# EAGLE schematic AlarmSt (EAGLE 4.16)

## Sheet 1 of 4
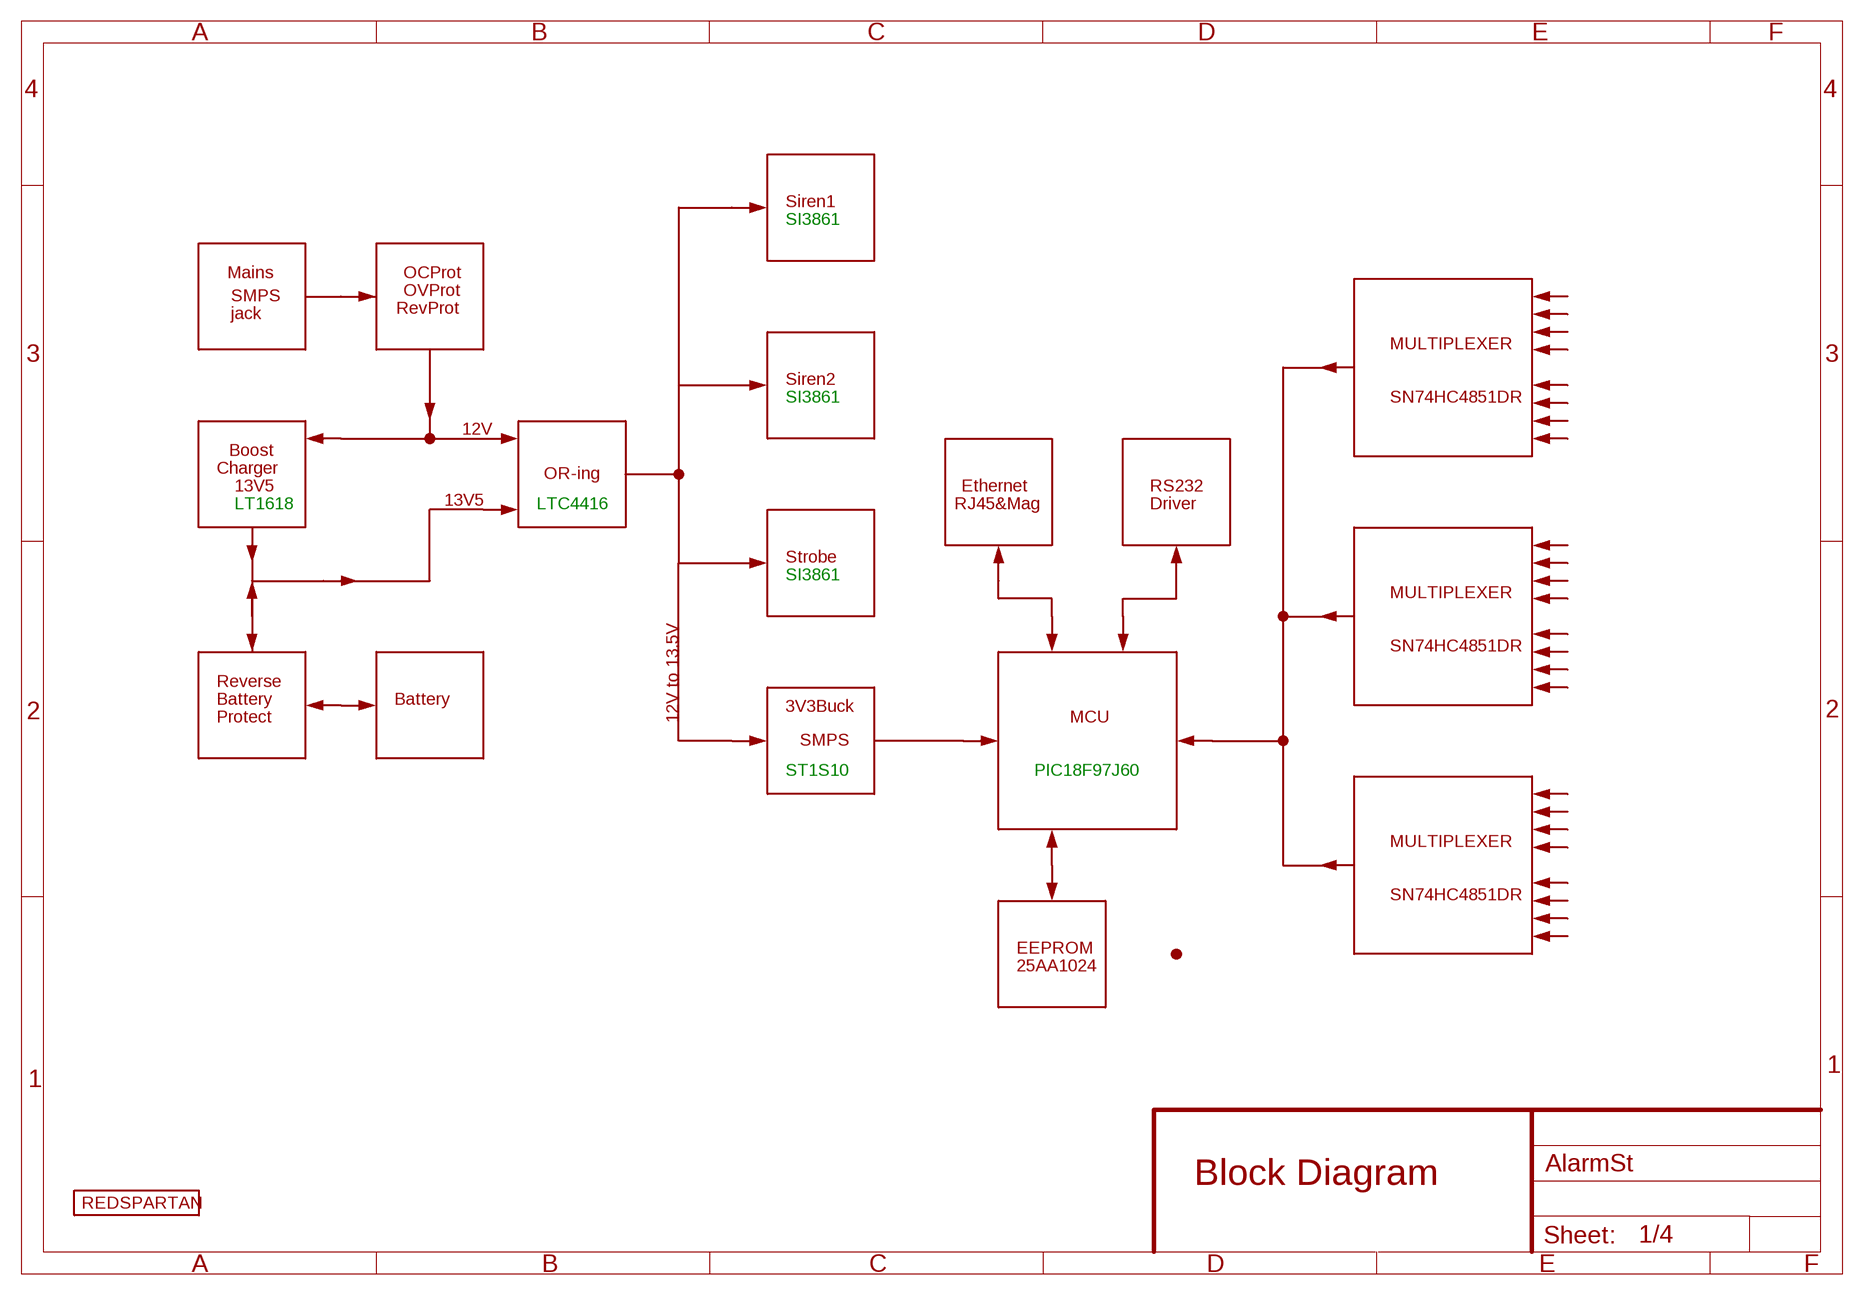
[diagram p0: schematic, sheet 1]

### Parts
LOGO1  LOGO-REDSPARTAN-2  [LOGO-REDSPARTAN-2]

### Notes on the sheet
- Siren1
- SI3861
- Mains | OCProt
- OVProt
- SMPS
- RevProt
- jack
- MULTIPLEXER
- Siren2
- SI3861 | SN74HC4851DR
- 12V
- Boost
- Charger
- OR-ing
- 13V5 | Ethernet | RS232
- LT1618 | 13V5 | LTC4416 | RJ45&Mag | Driver
- Strobe
- SI3861
- MULTIPLEXER
- SN74HC4851DR
- Reverse
- Battery | Battery
- 3V3Buck
- Protect | 12V to 13.5V | MCU
- SMPS
- ST1S10 | PIC18F97J60
- MULTIPLEXER
- SN74HC4851DR
- EEPROM
- 25AA1024
- Block Diagram

## Sheet 2 of 4
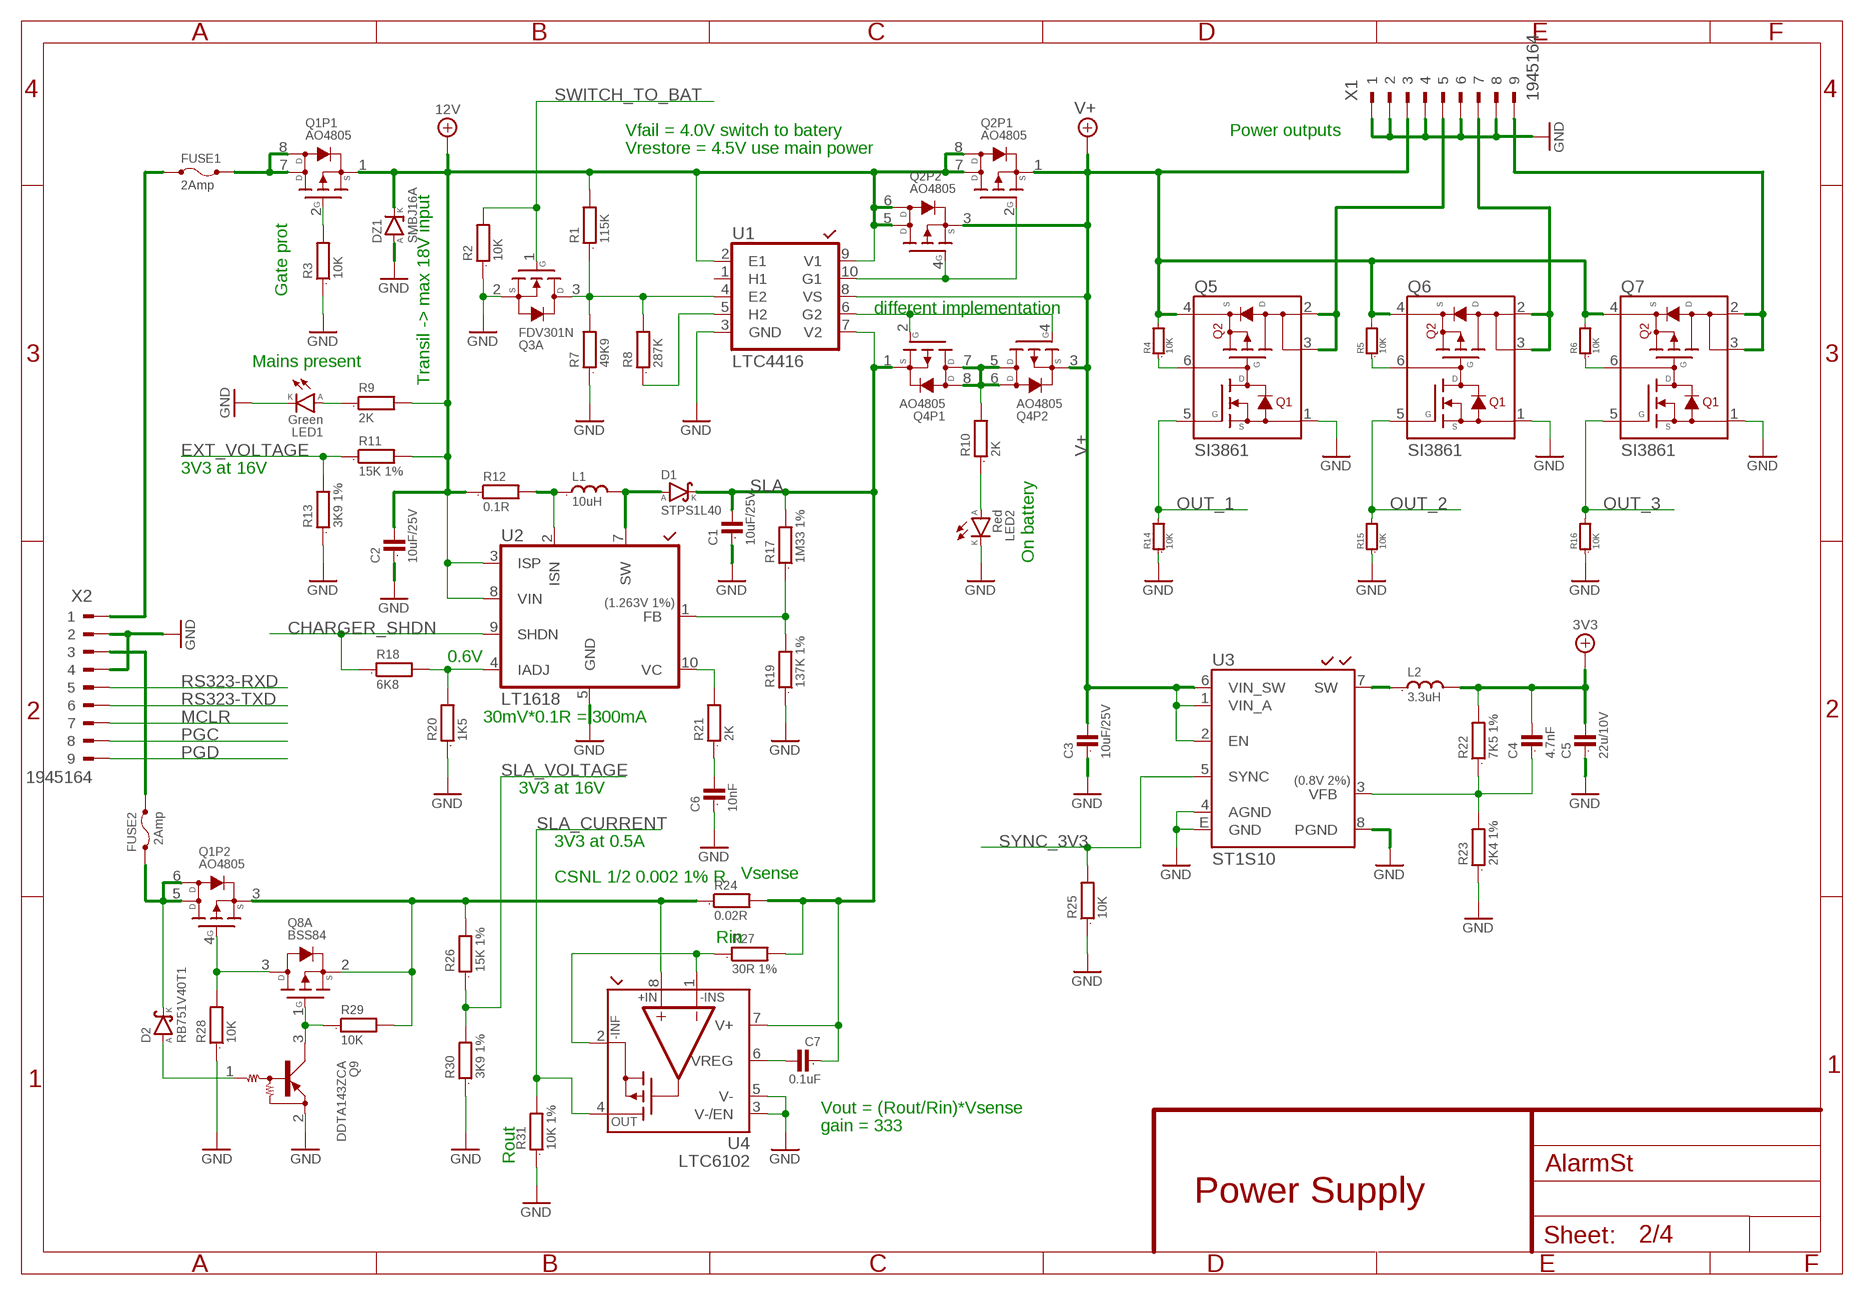
[diagram p1: schematic, sheet 2]

### Parts
C1  10uF/25V  C1206  [1206]
C2  10uF/25V  C1206  [1206]
C3  10uF/25V  C1206  [1206]
C4  4.7nF  C0603  [0603]
C5  22u/10V  C1206  [1206]
C6  10nF  C0603  [0603]
C7  0.1uF  C0603  [0603]
D1  STPS1L40  DIODE-SCHOTTKY_SMA  [SMA]
D2  RB751V40T1  DIODE-SCHOTTKY_SOD323  [SOD323]
DZ1  SMBJ16A  DIODE-ZENER_SMB  [SMB]
FUSE1  2Amp  FUSE1210  [1210]
FUSE2  2Amp  FUSE1210  [1210]
L1  10uH  L_VLS3015  [VLS3015]
L2  3.3uH  L_VLS3015  [VLS3015]
LED1  Green  LED0805  [LED0805]
LED2  Red  LED0805  [LED0805]
Q1  AO4805  TRANSISTOR-MOSFET-PAIR-P&P-8P_SO08  [SO08]
Q2  AO4805  TRANSISTOR-MOSFET-PAIR-P&P-8P_SO08  [SO08]
Q3  FDV301N  TRANSISTOR-MOSFET-N-ENH_SOT23-1  [SOT23]
Q4  AO4805  TRANSISTOR-MOSFET-PAIR-P&P-8P_SO08  [SO08]
Q5  SI3861  TRANSISTOR-MOSFET-PAIR-SWITCH-1_SSOT6  [SSOT6]
Q6  SI3861  TRANSISTOR-MOSFET-PAIR-SWITCH-1_SSOT6  [SSOT6]
Q7  SI3861  TRANSISTOR-MOSFET-PAIR-SWITCH-1_SSOT6  [SSOT6]
Q8  BSS84  TRANSISTOR-MOSFET-P-ENH_SOT23-1  [SOT23]
Q9  DDTA143ZCA  TRANSISTOR-BJT-PNP-DRIVER-RB-RE_SOT23  [SOT23]
R1  115K  R0603  [0603]
R2  10K  R0603  [0603]
R3  10K  R0603  [0603]
R4  10K  R-SMALL0603  [0603]
R5  10K  R-SMALL0603  [0603]
R6  10K  R-SMALL0603  [0603]
R7  49K9  R0603  [0603]
R8  287K  R0603  [0603]
R9  2K  R0603  [0603]
R10  2K  R0603  [0603]
R11  15K 1%  R0603  [0603]
R12  0.1R  R0805  [0805]
R13  3K9 1%  R0603  [0603]
R14  10K  R-SMALL0603  [0603]
R15  10K  R-SMALL0603  [0603]
R16  10K  R-SMALL0603  [0603]
R17  1M33 1%  R0603  [0603]
R18  6K8  R0603  [0603]
R19  137K 1%  R0603  [0603]
R20  1K5  R0603  [0603]
R21  2K  R0603  [0603]
R22  7K5 1%  R0603  [0603]
R23  2K4 1%  R0603  [0603]
R24  0.02R  R1210  [1210]
R25  10K  R0603  [0603]
R26  15K 1%  R0603  [0603]
R27  30R 1%  R0603  [0603]
R28  10K  R0603  [0603]
R29  10K  R0603  [0603]
R30  3K9 1%  R0603  [0603]
R31  10K 1%  R0603  [0603]
U1  LTC4416  [MSOP10]
U2  LT1618  [MSOP10]
U3  ST1S10  ST1S10_SO08  [SO08E]
U4  LTC6102  [MSOP8]
X1  1945164  180-9  [180-9]
X2  1945164  180-9  [180-9]

### Nets
3V3 [POWER]: C4.2 C5.2 L2.2 R22.2 ; also sheet 3,4
12V: C2.2 DZ1.K Q1.1(P1:S) Q2.5(P2:D) Q2.6(P2-D2:D) Q2.7(P1:D) Q2.8(P1-D2:D) R1.2 R9.2 R11.2 R12.1 U1.2(E1) U1.9(V1) U2.3(ISP) U2.8(VIN)
12V_FUSED [POWER]: FUSE1.2 Q1.7(P1:D) Q1.8(P1-D2:D)
CHARGER_SHDN: R18.1 U2.9(SHDN) ; also sheet 3
EXT_VOLTAGE: R11.1 R13.2 ; also sheet 3
GND: C1.1 C2.1 C3.1 C5.1 C6.1 DZ1.A LED1.K LED2.K Q3.2(A:S) Q5.1(Q1S) Q6.1(Q1S) Q7.1(Q1S) Q9.2(E) R2.1 R3.1 R7.1 R13.1 R14.1 R15.1 R16.1 R19.1 R20.1 R23.1 R25.1 R28.1 R30.1 R31.1 U1.3(GND) U2.5(GND) U3.4(AGND) U3.8(PGND) U3.E(GND) U4.3(V-/EN) U4.5(V-) X1.1 X1.2 X1.4 X1.6 X1.8 X2.2 X2.4 ; also sheet 3,4
MCLR: X2.7 ; also sheet 3
N$1: Q4.5(P2:D) Q4.6(P2-D2:D) Q4.7(P1:D) Q4.8(P1-D2:D) R10.2
N$2: Q4.2(P1G:G) Q4.4(P2G:G) U1.6(G2)
N$3: Q1.3(P2:S) Q8.2(A:S) R24.1 R26.2 R29.2 U4.8(+IN)
N$4: Q2.2(P1G:G) Q2.4(P2G:G) U1.10(G1)
N$5: D1.A L1.2 U2.7(SW)
N$6: L1.1 R12.2 U2.2(ISN)
N$7: R21.2 U2.10(VC)
N$8: Q3.3(A:D) R1.1 R7.2 R8.2 U1.4(E2)
N$9: R18.2 R20.2 U2.4(IADJ)
N$10: C6.2 R21.1
N$11: R17.1 R19.2 U2.1(FB)
N$13: R8.1 U1.5(H2)
N$20: Q5.2(Q2D) Q5.3(Q2D) X1.5
N$21: Q6.2(Q2D) Q6.3(Q2D) X1.7
N$22: Q7.2(Q2D) Q7.3(Q2D) X1.9
N$23: Q5.6(Q2G) R4.1
N$24: Q6.6(Q2G) R5.1
N$25: Q7.6(Q2G) R6.1
N$29: FUSE1.1 X2.1
N$30: Q1.4(P2G:G) Q8.3(A:D) R28.2
N$31: FUSE2.1 X2.3
N$32: Q8.1(G:G) Q9.3(C) R29.1
N$33: D2.A Q9.1(B)
N$35: LED1.A R9.1
N$36: LED2.A R10.1
N$69: D2.K FUSE2.2 Q1.5(P2:D) Q1.6(P2-D2:D)
N$71: R27.1 U4.1(-INS) U4.2(-INF)
N$72: C7.2 U4.6(VREG)
OUT_1: Q5.5(Q1G) R14.2 ; also sheet 3
OUT_2: Q6.5(Q1G) R15.2 ; also sheet 3
OUT_3: Q7.5(Q1G) R16.2 ; also sheet 3
PGC: X2.8 ; also sheet 3
PGD: X2.9 ; also sheet 3
REV_PROT_GATE: Q1.2(P1G:G) R3.2
RS323-RXD: X2.5 ; also sheet 3
RS323-TXD: X2.6 ; also sheet 3
SLA: C1.2 C7.1 D1.K Q4.1(P1:S) R17.2 R24.2 R27.2 U1.7(V2) U4.7(V+)
SLA_CURRENT: R31.2 U4.4(OUT) ; also sheet 3
SLA_VOLTAGE: R26.1 R30.2 ; also sheet 3
SW_3V3 [POWER]: L2.1 U3.7(SW)
SWITCH_TO_BAT: Q3.1(G:G) R2.2 ; also sheet 3
SYNC_3V3: R25.2 U3.5(SYNC) ; also sheet 3
V+: C3.2 Q2.1(P1:S) Q2.3(P2:S) Q4.3(P2:S) Q5.4(Q2S) Q6.4(Q2S) Q7.4(Q2S) R4.2 R5.2 R6.2 U1.8(VS) U3.1(VIN_A) U3.2(EN) U3.6(VIN_SW) X1.3
VFB_3V3: C4.1 R22.1 R23.2 U3.3(VFB)
Unconnected: U1.1(H1)

### Notes on the sheet
- Vfail = 4.0V switch to batery | Power outputs
- Vrestore = 4.5V use main power
- Gate prot
- different implementation
- Mains present
- Transil -> max 18V input
- 3V3 at 16V
- On battery
- 0.6V
- 30mV*0.1R = 300mA
- 3V3 at 16V
- 3V3 at 0.5A
- CSNL 1/2 0.002 1% R | Vsense
- Rin
- Vout = (Rout/Rin)*Vsense
- gain = 333
- Rout
- Power Supply

## Sheet 3 of 4
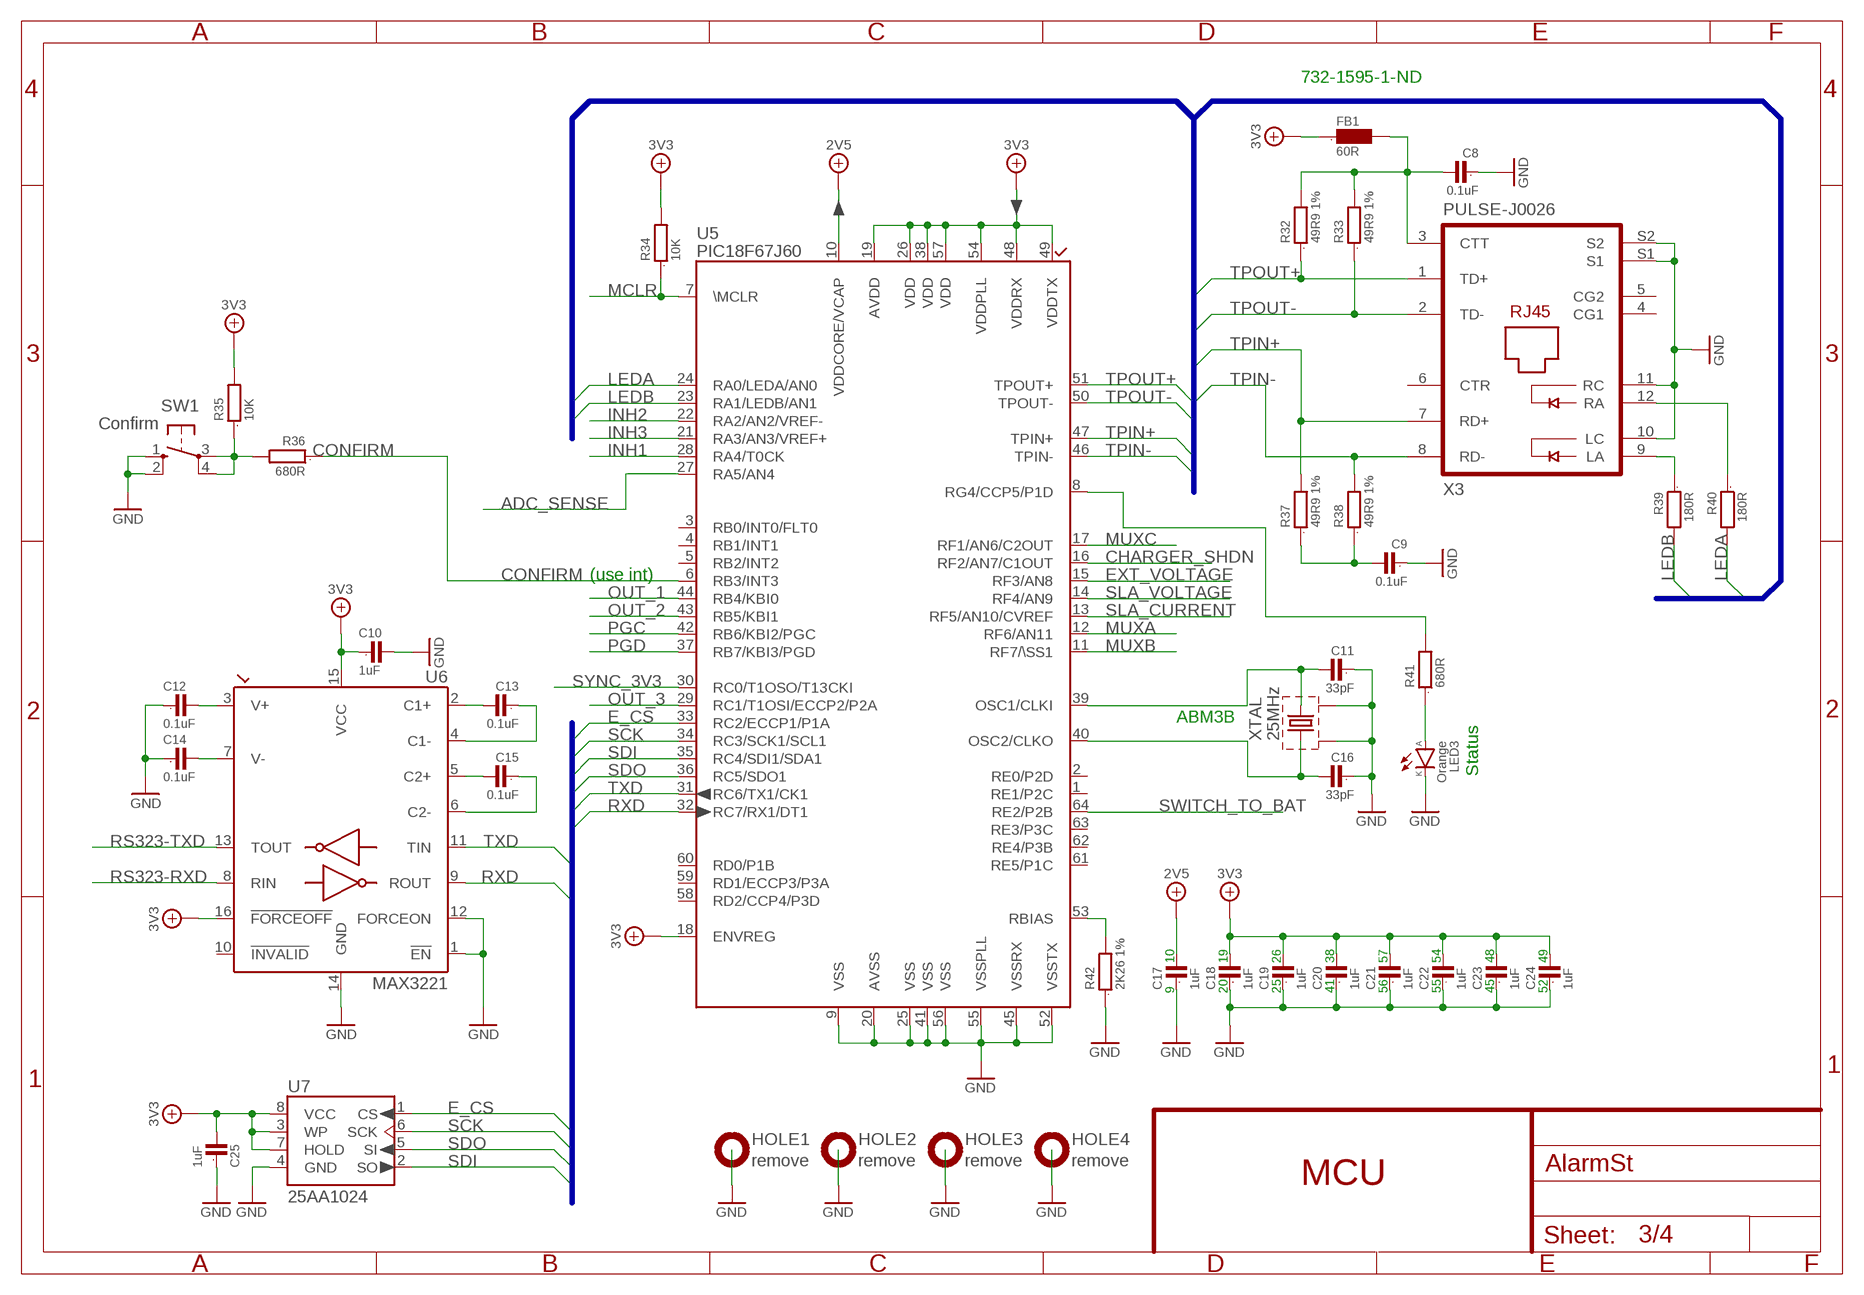
[diagram p2: schematic, sheet 3]

### Parts
C8  0.1uF  C0603  [0603]
C9  0.1uF  C0603  [0603]
C10  1uF  C0603  [0603]
C11  33pF  C0603  [0603]
C12  0.1uF  C0603  [0603]
C13  0.1uF  C0603  [0603]
C14  0.1uF  C0603  [0603]
C15  0.1uF  C0603  [0603]
C16  33pF  C0603  [0603]
C17  1uF  C0603  [0603]
C18  1uF  C0603  [0603]
C19  1uF  C0603  [0603]
C20  1uF  C0603  [0603]
C21  1uF  C0603  [0603]
C22  1uF  C0603  [0603]
C23  1uF  C0603  [0603]
C24  1uF  C0603  [0603]
C25  1uF  C0603  [0603]
FB1  60R  FB0603  [0603]
HOLE1  remove  MOUNTING-HOLE_3.2  [MOUNTING-HOLE-3.2MM]
HOLE2  remove  MOUNTING-HOLE_3.2  [MOUNTING-HOLE-3.2MM]
HOLE3  remove  MOUNTING-HOLE_3.2  [MOUNTING-HOLE-3.2MM]
HOLE4  remove  MOUNTING-HOLE_3.2  [MOUNTING-HOLE-3.2MM]
LED3  Orange  LED0805  [LED0805]
R32  49R9 1%  R0603  [0603]
R33  49R9 1%  R0603  [0603]
R34  10K  R0603  [0603]
R35  10K  R0603  [0603]
R36  680R  R0603  [0603]
R37  49R9 1%  R0603  [0603]
R38  49R9 1%  R0603  [0603]
R39  180R  R0603  [0603]
R40  180R  R0603  [0603]
R41  680R  R0603  [0603]
R42  2K26 1%  R0603  [0603]
SW1  Confirm  BUTTON-10-XX  [BUTTON-B3F-10XX]
U5  PIC18F67J60  PIC18F6XJ6X  [TQFP64]
U6  MAX3221  [TSSOP16]
U7  25AA1024  DIGITAL-EEPROM-SPI-8P  [SO08]
X3  PULSE-J0026  [PULSE-PJ-J0]
XTAL  25MHz  CRYSTAL-4P_ABM3B  [ABM3B]

### Nets
2V5: C17.2 U5.10(VDDCORE/VCAP)
3V3 [POWER]: C10.1 C18.2 C19.2 C20.2 C21.2 C22.2 C23.2 C24.2 C25.2 FB1.1 R34.2 R35.2 U5.18(ENVREG) U5.19(AVDD) U5.26(VDD) U5.38(VDD) U5.48(VDDRX) U5.49(VDDTX) U5.54(VDDPLL) U5.57(VDD) U6.15(VCC) U6.16(!FORCEOFF) U7.3(WP) U7.7(HOLD) U7.8(VCC) ; also sheet 2,4
ADC_SENSE: U5.27(RA5/AN4) ; also sheet 4
CHARGER_SHDN: U5.16(RF2/AN7/C1OUT) ; also sheet 2
CONFIRM: R36.1 U5.6(RB3/INT3)
E_CS: U5.33(RC2/ECCP1/P1A) U7.1(CS)
EXT_VOLTAGE: U5.15(RF3/AN8) ; also sheet 2
GND: C8.1 C9.1 C10.2 C11.1 C12.1 C14.1 C16.1 C17.1 C18.1 C19.1 C20.1 C21.1 C22.1 C23.1 C24.1 C25.1 HOLE1.VIA(MOUNT) HOLE2.VIA(MOUNT) HOLE3.VIA(MOUNT) HOLE4.VIA(MOUNT) LED3.K R42.1 SW1.1(S) SW1.2(S1) U5.9(VSS) U5.20(AVSS) U5.25(VSS) U5.41(VSS) U5.45(VSSRX) U5.52(VSSTX) U5.55(VSSPLL) U5.56(VSS) U6.1(!EN) U6.12(FORCEON) U6.14(GND) U7.4(GND) X3.10(LC) X3.11(RC) X3.S1 X3.S2 XTAL.2(SH1) XTAL.4(SH2) ; also sheet 2,4
INH1: U5.28(RA4/T0CK) ; also sheet 4
INH2: U5.22(RA2/AN2/VREF-) ; also sheet 4
INH3: U5.21(RA3/AN3/VREF+) ; also sheet 4
LEDA: R40.2 U5.24(RA0/LEDA/AN0)
LEDB: R39.2 U5.23(RA1/LEDB/AN1)
MCLR: R34.1 U5.7(\MCLR) ; also sheet 2
MUXA: U5.12(RF6/AN11) ; also sheet 4
MUXB: U5.11(RF7/\SS1) ; also sheet 4
MUXC: U5.17(RF1/AN6/C2OUT) ; also sheet 4
N$12: R40.1 X3.12(RA)
N$14: R42.2 U5.53(RBIAS)
N$15: C9.2 R37.1 R38.1
N$16: C8.2 FB1.2 R32.2 R33.2 X3.3(CTT)
N$17: R39.1 X3.9(LA)
N$18: C11.2 U5.39(OSC1/CLKI) XTAL.3
N$19: C16.2 U5.40(OSC2/CLKO) XTAL.1
N$26: R41.2 U5.8(RG4/CCP5/P1D)
N$34: C12.2 U6.3(V+)
N$38: LED3.A R41.1
N$63: R35.1 R36.2 SW1.3(P) SW1.4(P1)
N$64: C14.2 U6.7(V-)
N$65: C13.2 U6.2(C1+)
N$66: C13.1 U6.4(C1-)
N$67: C15.2 U6.5(C2+)
N$68: C15.1 U6.6(C2-)
OUT_1: U5.44(RB4/KBI0) ; also sheet 2
OUT_2: U5.43(RB5/KBI1) ; also sheet 2
OUT_3: U5.29(RC1/T1OSI/ECCP2/P2A) ; also sheet 2
PGC: U5.42(RB6/KBI2/PGC) ; also sheet 2
PGD: U5.37(RB7/KBI3/PGD) ; also sheet 2
RS323-RXD: U6.8(RIN) ; also sheet 2
RS323-TXD: U6.13(TOUT) ; also sheet 2
RXD: U5.32(RC7/RX1/DT1) U6.9(ROUT)
SCK: U5.34(RC3/SCK1/SCL1) U7.6(SCK)
SDI: U5.35(RC4/SDI1/SDA1) U7.2(SO)
SDO: U5.36(RC5/SDO1) U7.5(SI)
SLA_CURRENT: U5.13(RF5/AN10/CVREF) ; also sheet 2
SLA_VOLTAGE: U5.14(RF4/AN9) ; also sheet 2
SWITCH_TO_BAT: U5.64(RE2/P2B) ; also sheet 2
SYNC_3V3: U5.30(RC0/T1OSO/T13CKI) ; also sheet 2
TPIN+: R37.2 U5.47(TPIN+) X3.7(RD+)
TPIN-: R38.2 U5.46(TPIN-) X3.8(RD-)
TPOUT+: R32.1 U5.51(TPOUT+) X3.1(TD+)
TPOUT-: R33.1 U5.50(TPOUT-) X3.2(TD-)
TXD: U5.31(RC6/TX1/CK1) U6.11(TIN)
Unconnected: U5.1(RE1/P2C) U5.2(RE0/P2D) U5.3(RB0/INT0/FLT0) U5.4(RB1/INT1) U5.5(RB2/INT2) U5.58(RD2/CCP4/P3D) U5.59(RD1/ECCP3/P3A) U5.60(RD0/P1B) U5.61(RE5/P1C) U5.62(RE4/P3B) U5.63(RE3/P3C) U6.10(!INVALID) X3.4(CG1) X3.5(CG2) X3.6(CTR)

### Buses
E_CS,SCK,SDO,SDI,TXD,RXD
TPOUT+,TPOUT-,TPIN+,TPIN-,LEDA,LEDB

### Notes on the sheet
- 732-1595-1-ND
- (use int)
- ABM3B
- Status
- 10 | 19 | 26 | 38 | 57 | 54 | 48 | 49
- 9 | 20 | 25 | 41 | 56 | 55 | 45 | 52
- MCU

## Sheet 4 of 4
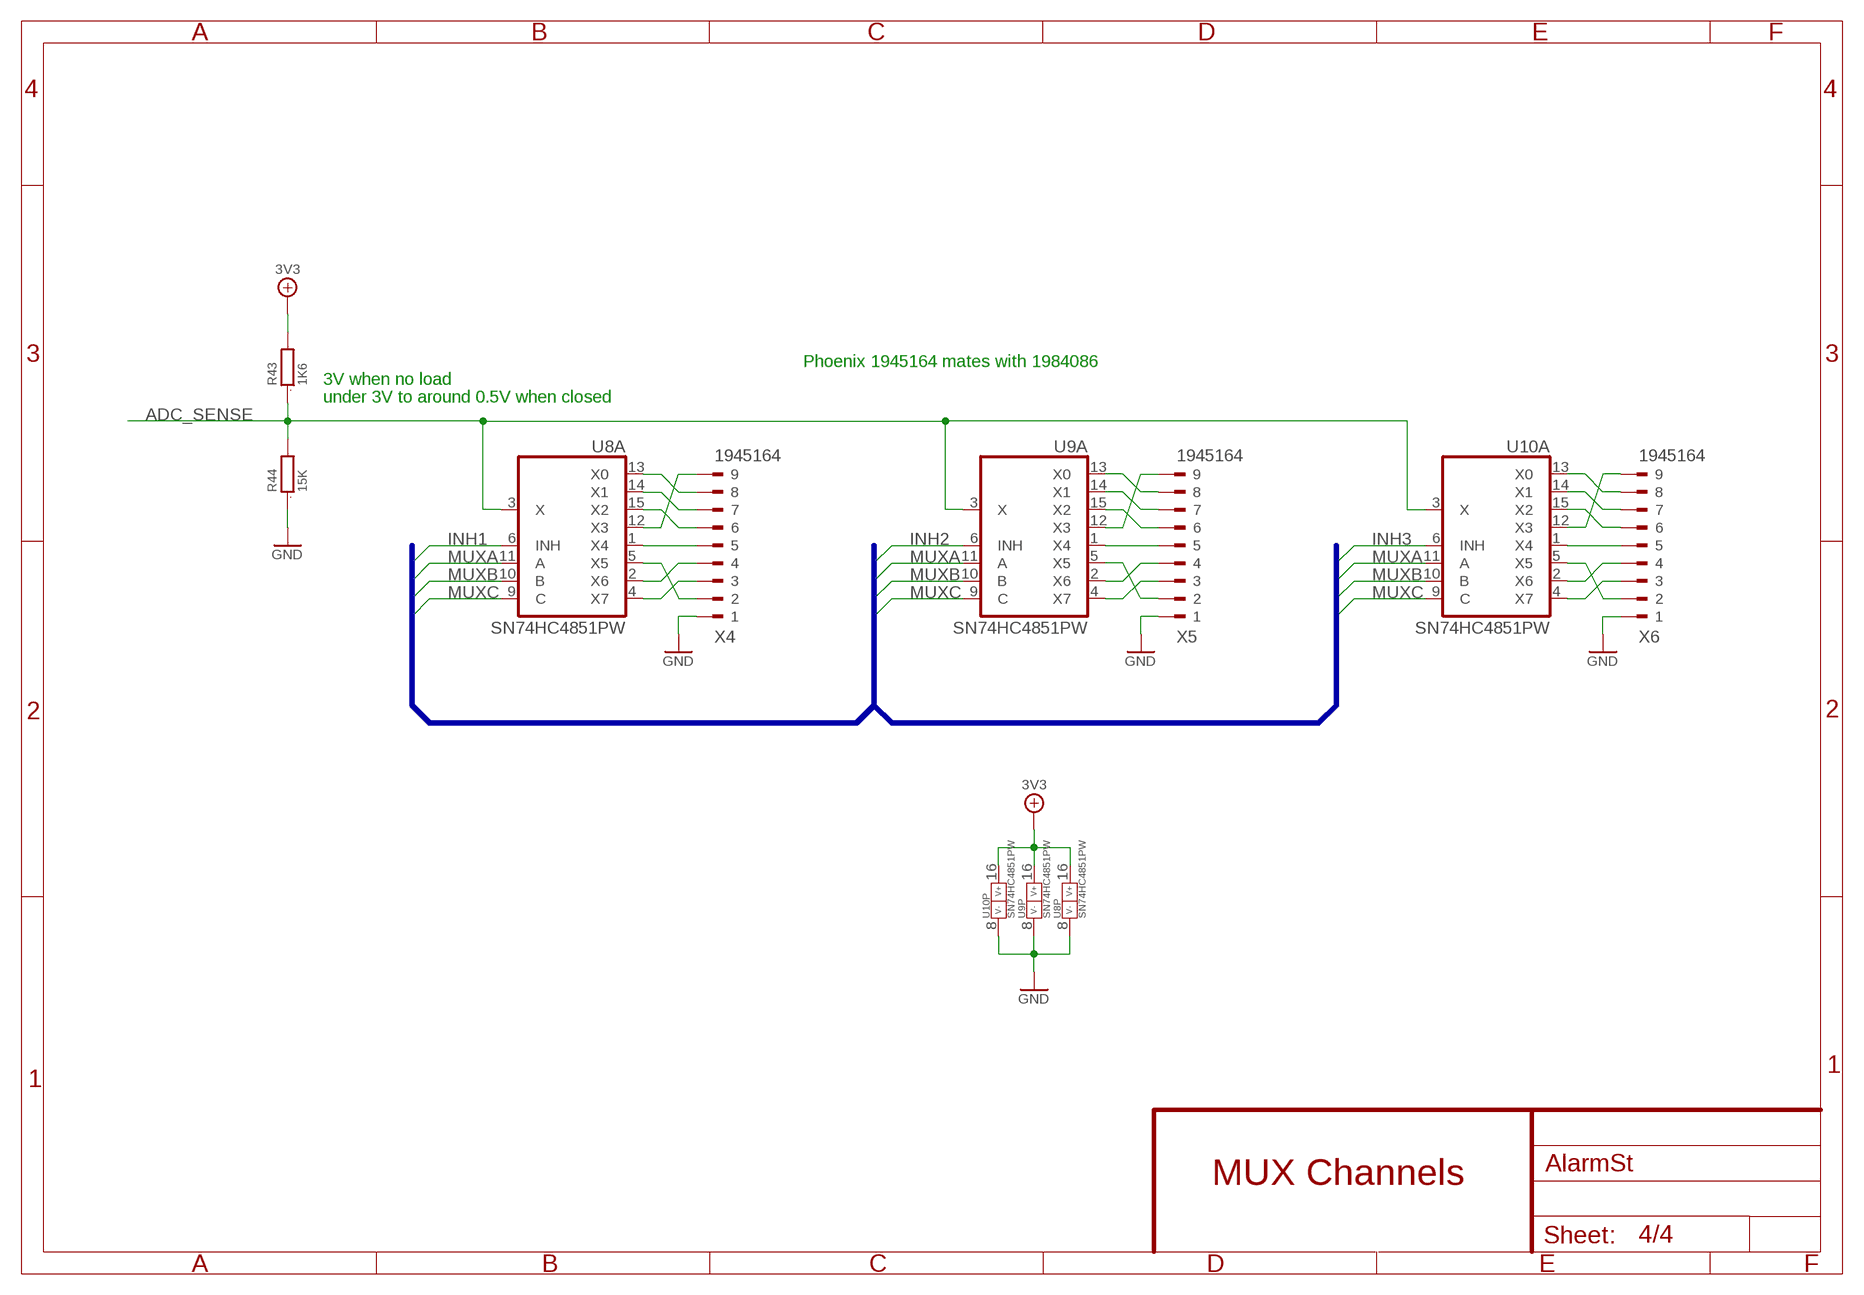
[diagram p3: schematic, sheet 4]

### Parts
R43  1K6  R0603  [0603]
R44  15K  R0603  [0603]
U8  SN74HC4851PW  ANALOG-MUX-8CH_TSSOP16  [TSSOP16]
U9  SN74HC4851PW  ANALOG-MUX-8CH_TSSOP16  [TSSOP16]
U10  SN74HC4851PW  ANALOG-MUX-8CH_TSSOP16  [TSSOP16]
X4  1945164  180-9  [180-9]
X5  1945164  180-9  [180-9]
X6  1945164  180-9  [180-9]

### Nets
3V3 [POWER]: R43.2 U8.16(P:V+) U9.16(P:V+) U10.16(P:V+) ; also sheet 2,3
ADC_SENSE: R43.1 R44.2 U8.3(A:X) U9.3(A:X) U10.3(A:X) ; also sheet 3
GND: R44.1 U8.8(P:V-) U9.8(P:V-) U10.8(P:V-) X4.1 X5.1 X6.1 ; also sheet 2,3
INH1: U8.6(A:INH) ; also sheet 3
INH2: U9.6(A:INH) ; also sheet 3
INH3: U10.6(A:INH) ; also sheet 3
MUXA: U8.11(A:A) U9.11(A:A) U10.11(A:A) ; also sheet 3
MUXB: U8.10(A:B) U9.10(A:B) U10.10(A:B) ; also sheet 3
MUXC: U8.9(A:C) U9.9(A:C) U10.9(A:C) ; also sheet 3
N$37: U8.13(A:X0) X4.8
N$39: U8.14(A:X1) X4.7
N$40: U8.15(A:X2) X4.6
N$41: U8.12(A:X3) X4.9
N$42: U8.1(A:X4) X4.5
N$43: U8.5(A:X5) X4.2
N$44: U8.2(A:X6) X4.4
N$45: U8.4(A:X7) X4.3
N$46: U9.13(A:X0) X5.8
N$47: U9.14(A:X1) X5.7
N$48: U9.15(A:X2) X5.6
N$49: U9.12(A:X3) X5.9
N$50: U9.5(A:X5) X5.2
N$51: U9.1(A:X4) X5.5
N$52: U9.2(A:X6) X5.4
N$53: U9.4(A:X7) X5.3
N$54: U10.13(A:X0) X6.8
N$55: U10.14(A:X1) X6.7
N$56: U10.15(A:X2) X6.6
N$57: U10.12(A:X3) X6.9
N$58: U10.5(A:X5) X6.2
N$59: U10.1(A:X4) X6.5
N$60: U10.2(A:X6) X6.4
N$61: U10.4(A:X7) X6.3

### Buses
INH[1..3],MUXA,MUXB,MUXC

### Notes on the sheet
- Phoenix 1945164 mates with 1984086
- 3V when no load
- under 3V to around 0.5V when closed
- MUX Channels

## Library data of the parts
C1-C25 = Bogdan_Commons:C: CAPACITOR, European symbol
D1 D2 = Bogdan_Commons:DIODE-SCHOTTKY
DZ1 = Bogdan_Commons:DIODE-ZENER
FB1 = Bogdan_Commons:FB
FUSE1 FUSE2 = Bogdan_Commons:FUSE
HOLE1-HOLE4 = Bogdan_Commons:MOUNTING-HOLE
L1 L2 = Bogdan_Commons:L: INDUCTOR, European symbol
LED1-LED3 = Bogdan_Commons:LED
LOGO1 = Logo_RedSpartan:LOGO-REDSPARTAN
Q1 Q2 Q4 = Bogdan_Commons:TRANSISTOR-MOSFET-PAIR-P&P-8P
Q3 = Bogdan_Commons:TRANSISTOR-MOSFET-N-ENH
Q5-Q7 = Bogdan_Commons:TRANSISTOR-MOSFET-PAIR-SWITCH-1: Load Switch with Level-Shift Si1869DH
Q8 = Bogdan_Commons:TRANSISTOR-MOSFET-P-ENH
Q9 = Bogdan_Commons:TRANSISTOR-BJT-PNP-DRIVER-RB-RE
R1-R3 R7-R13 R17-R44 = Bogdan_Commons:R: RESISTOR, European symbol
R4-R6 R14-R16 = Bogdan_Commons:R-SMALL
SW1 = Bogdan_Commons:BUTTON-10-XX: OMRON SWITCH
U1 = Bogdan_Commons:LTC4416: 36V, Low Loss Dual PowerPath Controllers for Large PFETs
U2 = Bogdan_Commons:LT1618: Constant-Current/Constant-Voltage 1.4MHz Step-Up DC/DC Converter
U3 = Bogdan_Commons:ST1S10: Excellent 3 A, 900 kHz, monolithic synchronous step-down regulator
U4 = Bogdan_Commons:LTC6102: Precision Zero Drift Current Sense Amplier
U5 = Bogdan_Commons:PIC18F6XJ6X: 64/80/100-Pin High-Performance, 1-Mbit Flash Microcontrollers with Ethernet
U6 = Bogdan_Commons:MAX3221: 3.0V to 5.5V, 250kbps, RS-232 Transceiver with AutoShutdown
U7 = Bogdan_Commons:DIGITAL-EEPROM-SPI-8P
U8-U10 = Bogdan_Commons:ANALOG-MUX-8CH: SN74HC4851
X1 X2 X4-X6 = con-weidmueller-sl35:180-9: WEIDMUELLER CLAMP CONNECTOR
X3 = Bogdan_Commons:PULSE-J0026: RJ45 PulseJack w/LEDs
XTAL = Bogdan_Commons:CRYSTAL-4P

## Net classes
3 POWER: width 0.2 mm